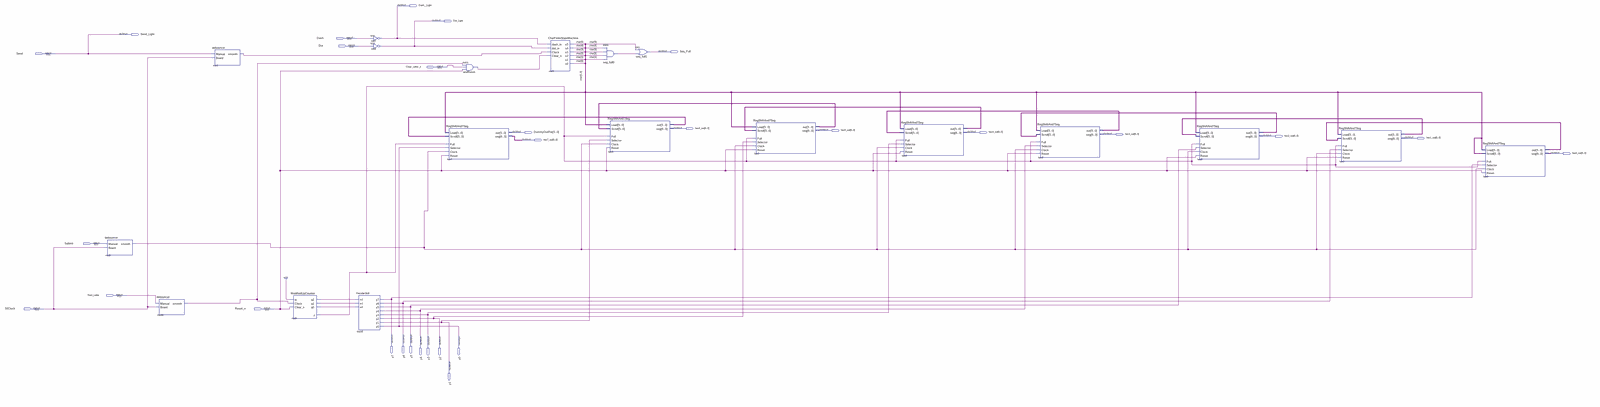
[diagram p0: schematic sheet, whole]
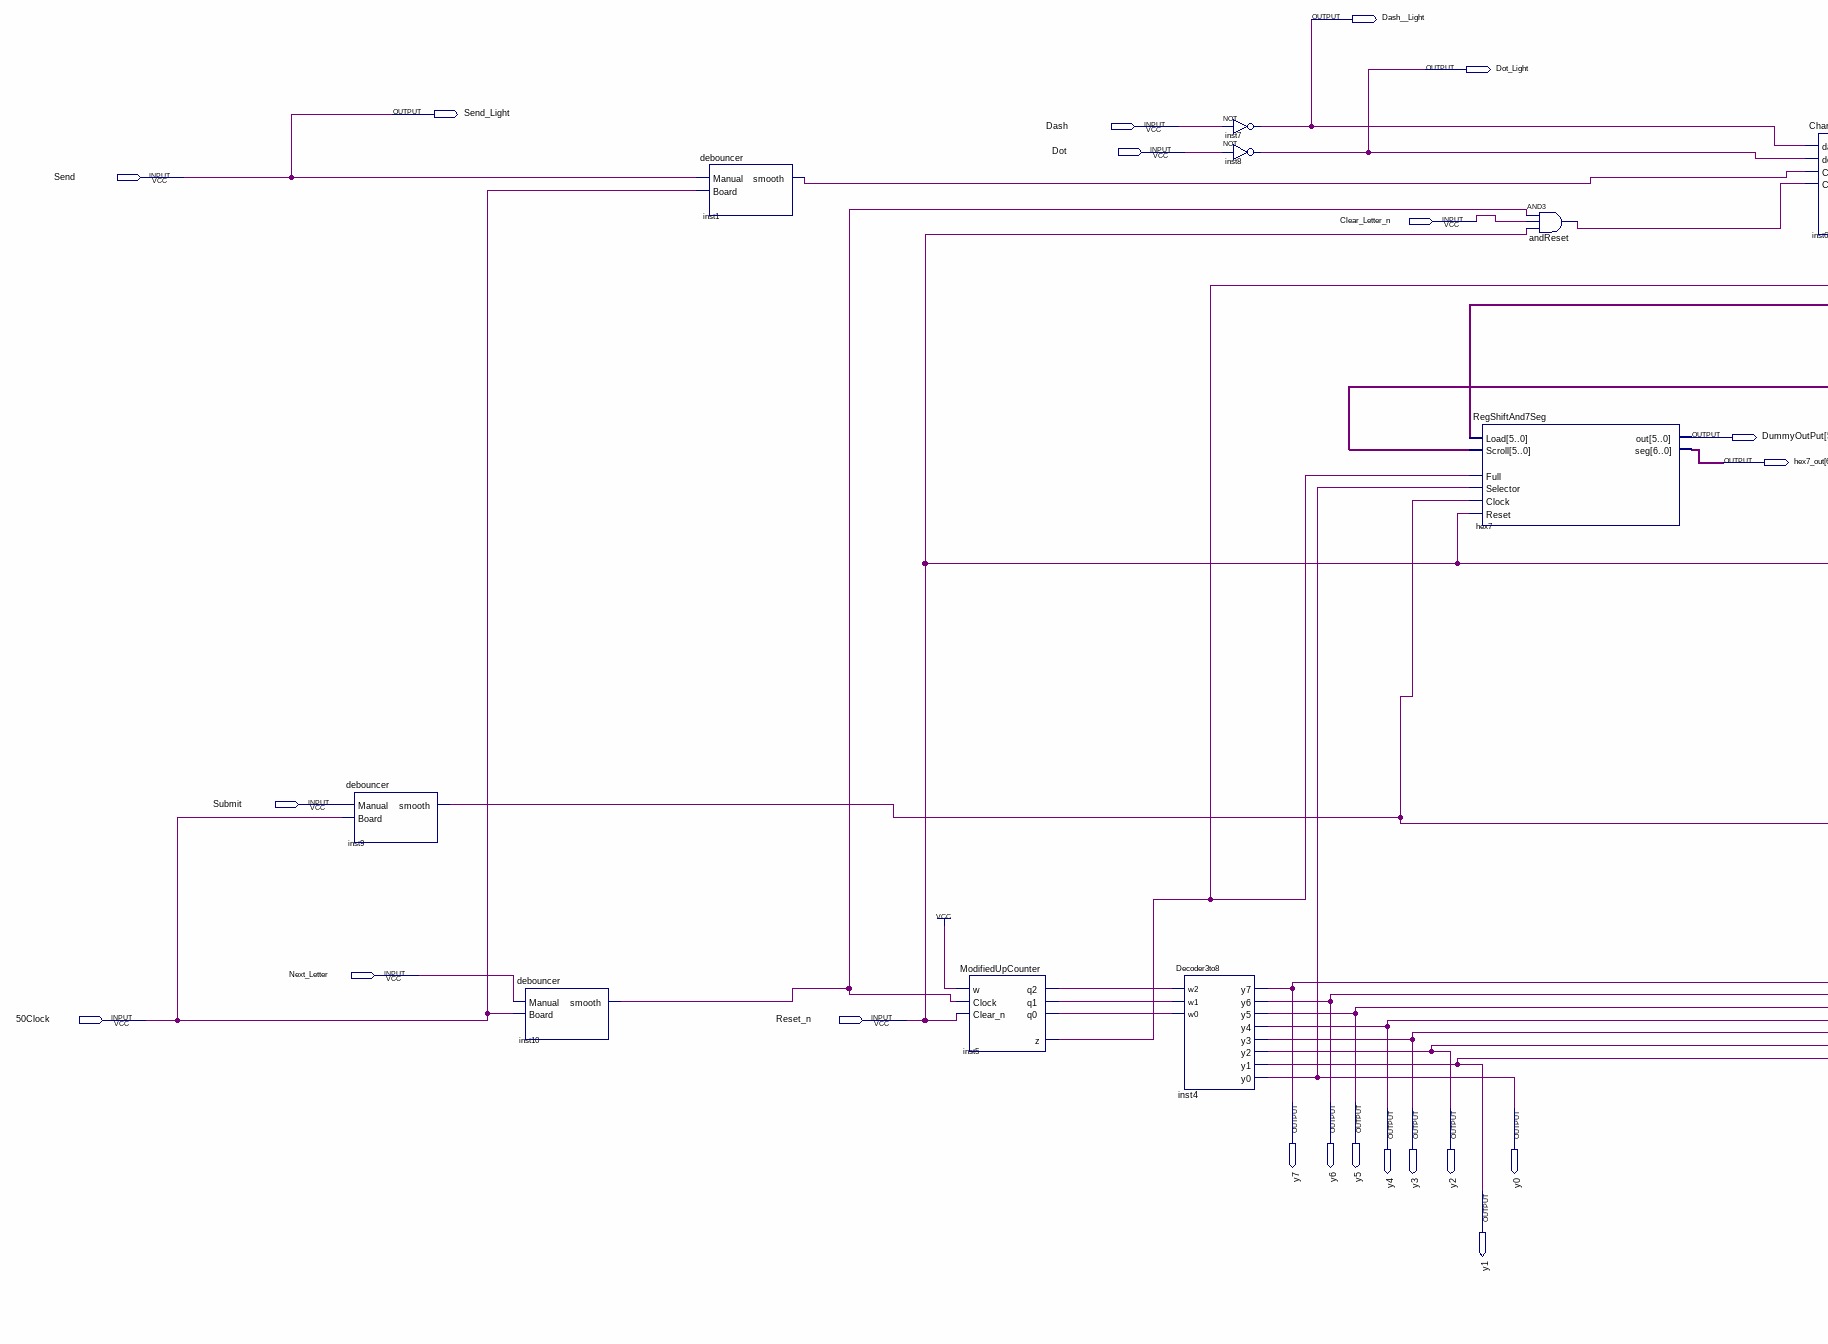
[diagram p1: schematic sheet, left part]
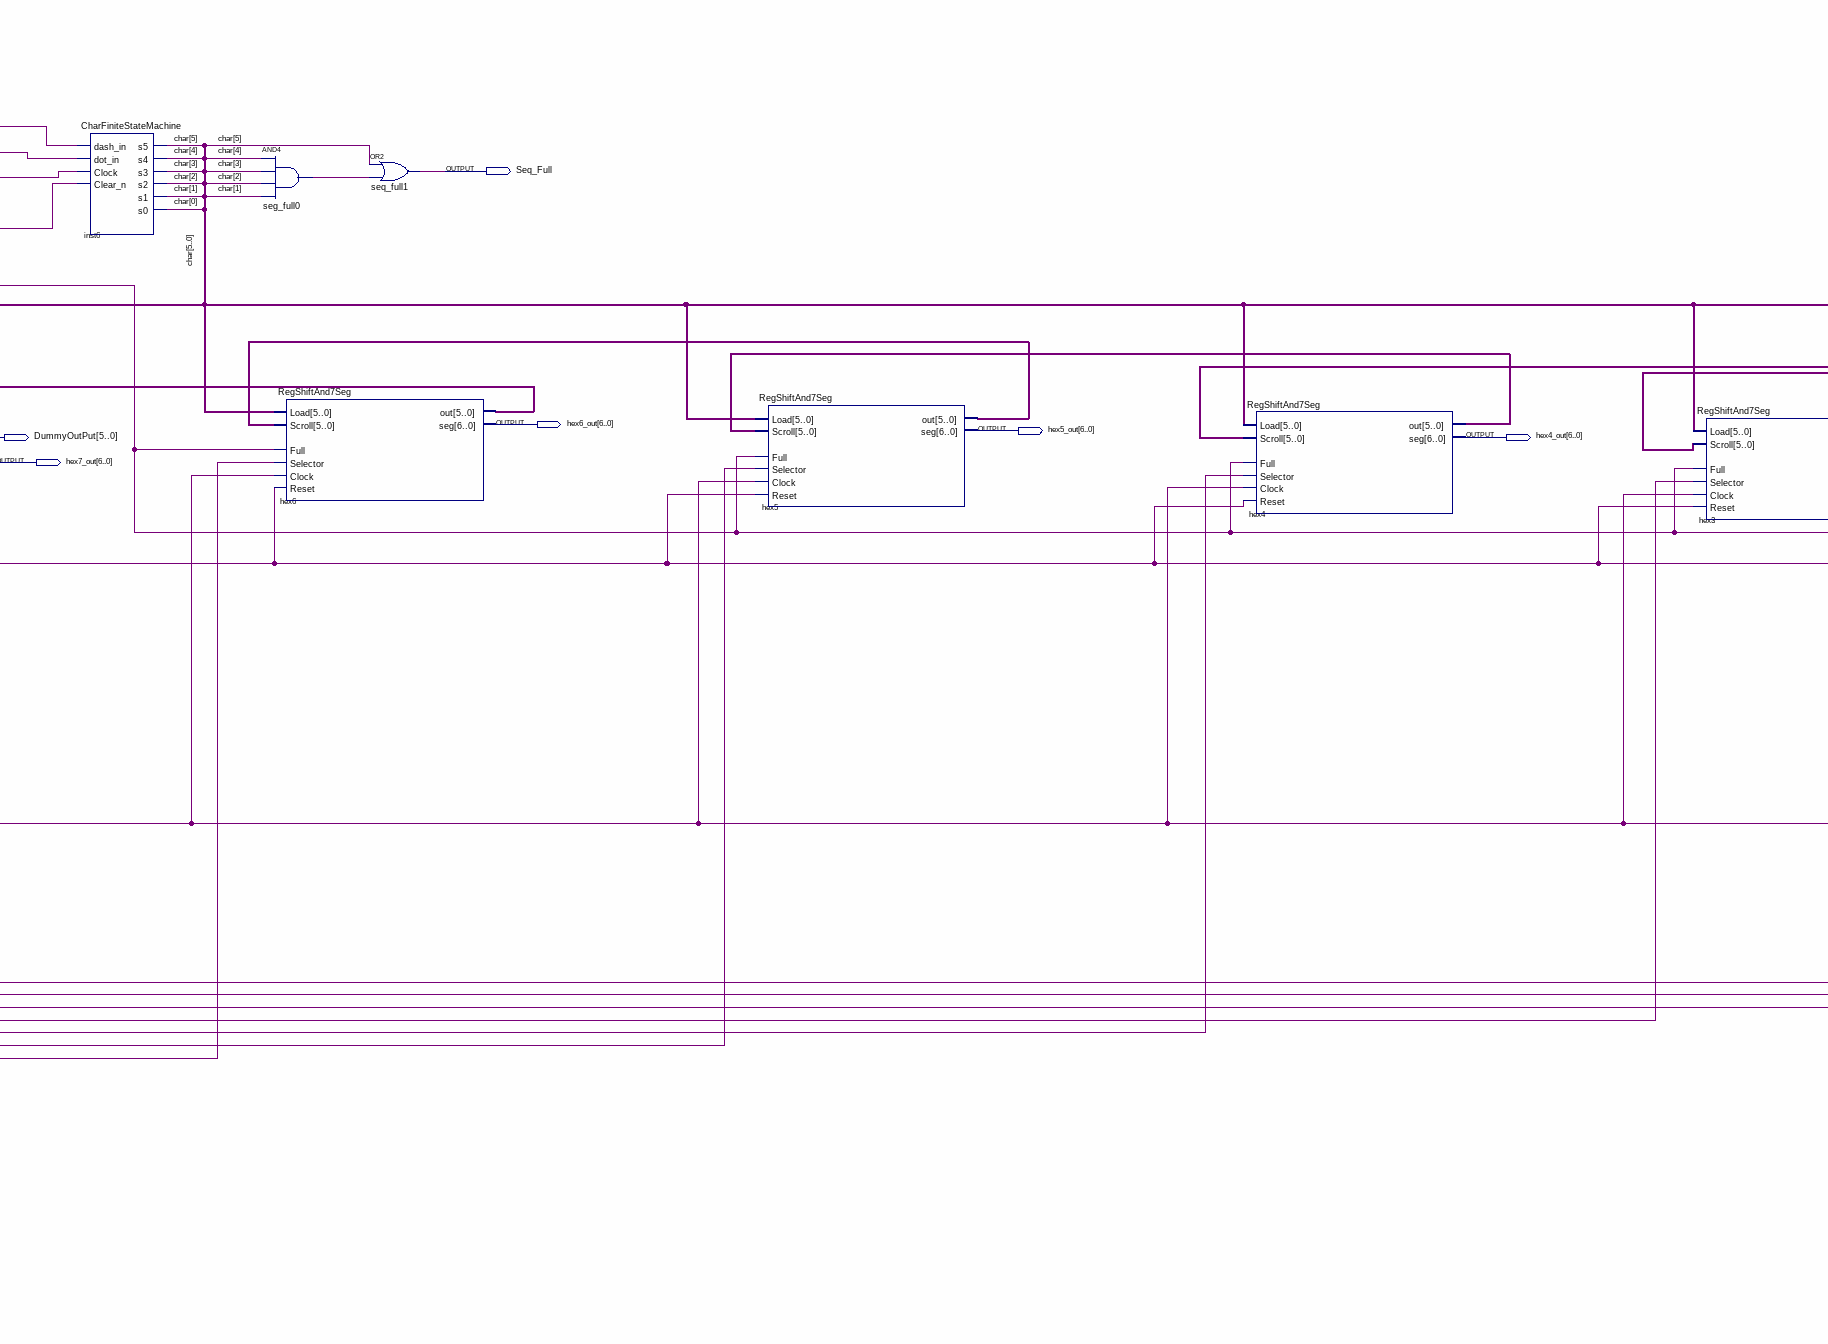
[diagram p2: schematic sheet, centre part]
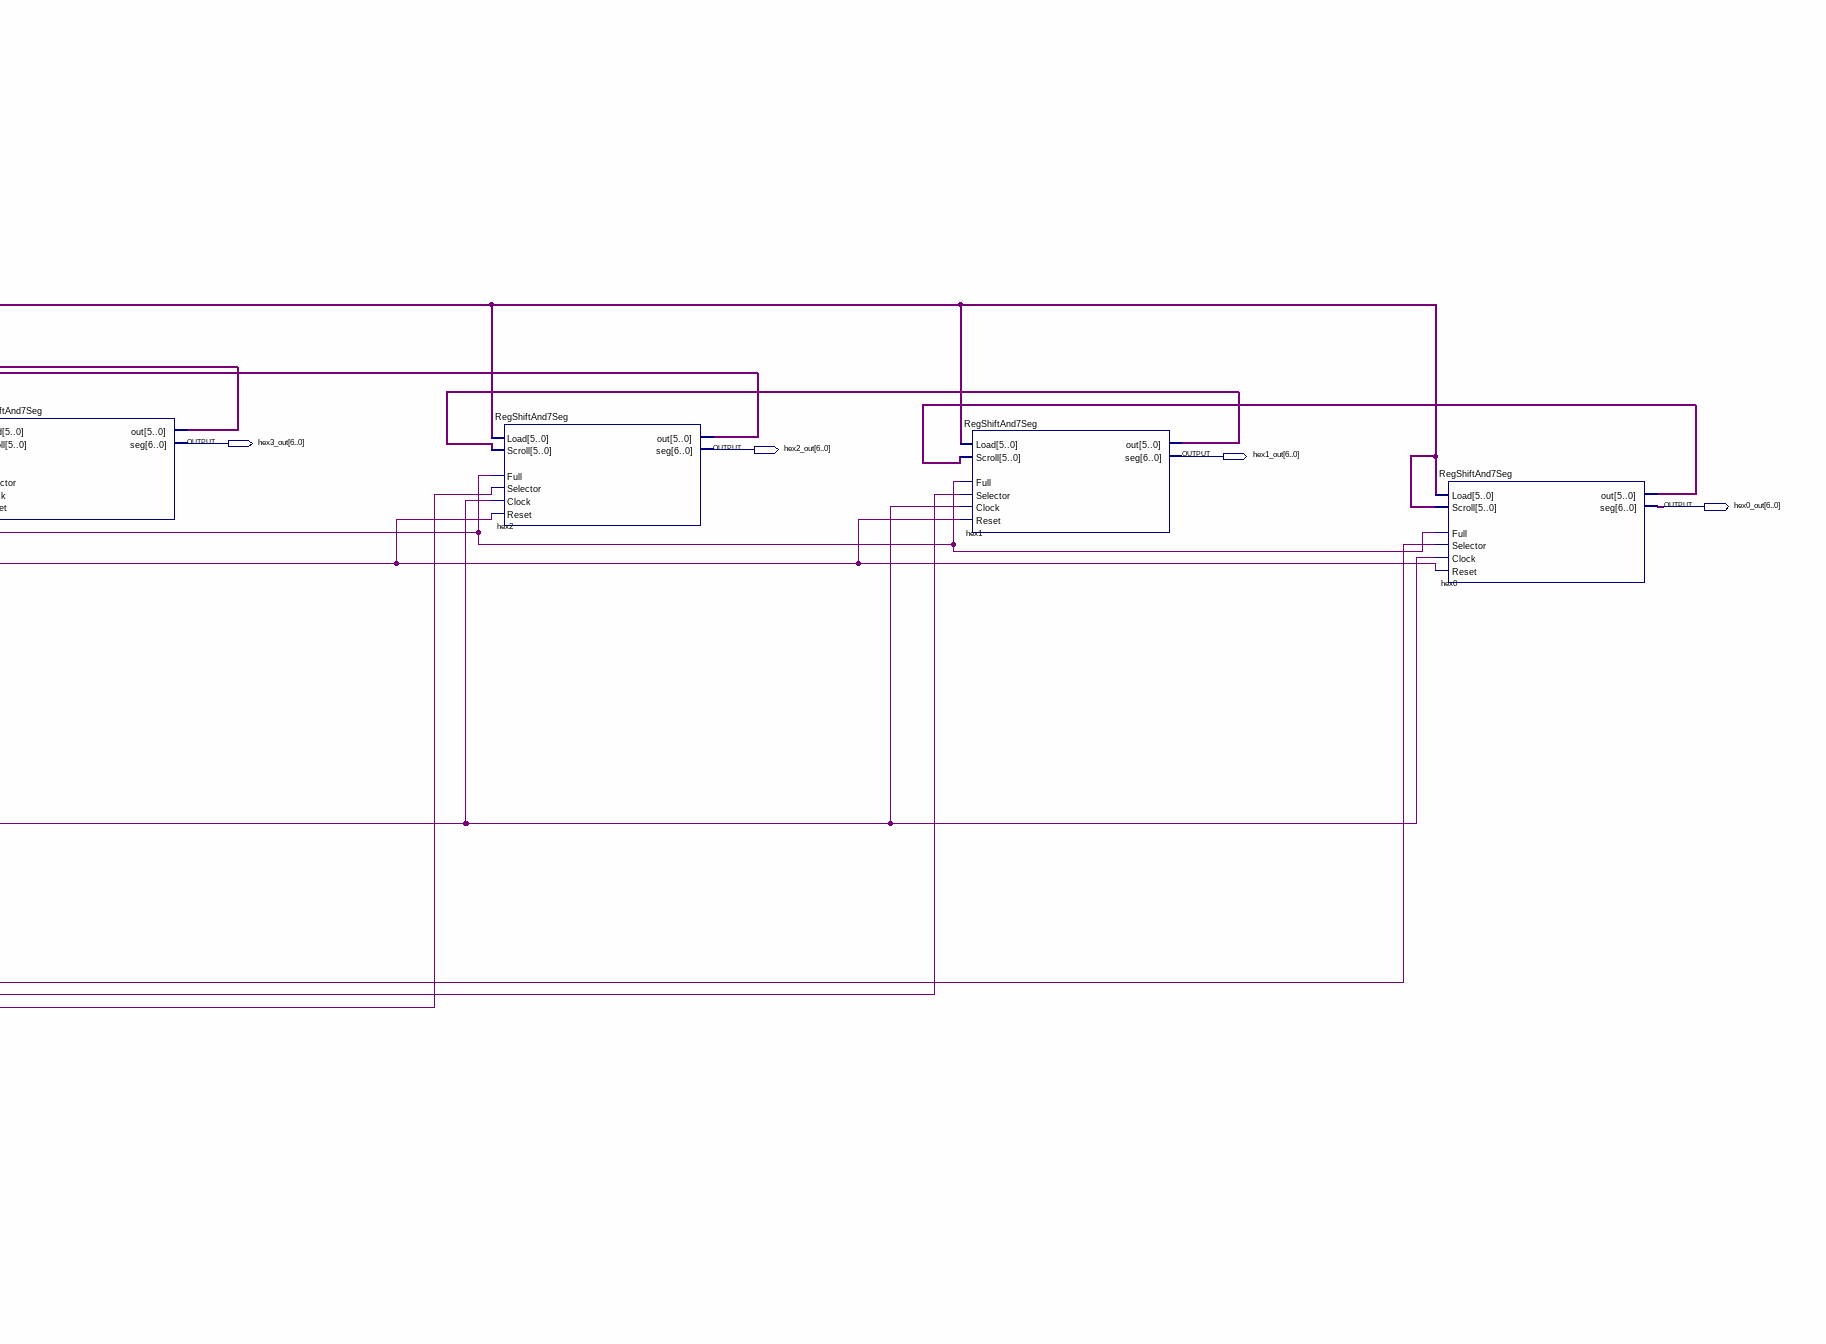
[diagram p3: schematic sheet, right part]
// Quartus schematic MorseCodeDecoder.bdf as structural Verilog: 19 symbols, 29 pins
module MorseCodeDecoder (
  input  Dash,
  input  Dot,
  input  Send,
  input  Clear_Letter_n,
  input  Submit,
  input  Next_Letter,
  input  \50Clock ,
  input  Reset_n,
  output Dash__Light,
  output Dot_Light,
  output Send_Light,
  output Seq_Full,
  output [6:0] hex6_out,
  output [6:0] hex5_out,
  output [5:0] DummyOutPut,
  output [6:0] hex4_out,
  output [6:0] hex3_out,
  output [6:0] hex2_out,
  output [6:0] hex1_out,
  output [6:0] hex7_out,
  output [6:0] hex0_out,
  output y7,
  output y6,
  output y5,
  output y4,
  output y3,
  output y2,
  output y0,
  output y1
);

  wire andReset_out, inst1_smooth, inst5_q0, inst5_q1, inst5_q2, inst5_z, inst9_smooth, inst10_smooth,
       seg_full0_out;
  wire [5:0] char, hex0_out_2, hex1_out_2, hex2_out_2, hex3_out_2, hex4_out_2, hex5_out_2, hex6_out_2;

  debouncer inst9 (.Manual(Submit), .Board(\50Clock ), .smooth(inst9_smooth));
  debouncer inst10 (.Manual(Next_Letter), .Board(\50Clock ), .smooth(inst10_smooth));
  debouncer inst1 (.Manual(Send), .Board(\50Clock ), .smooth(inst1_smooth));
  ModifiedUpCounter inst5 (
    .w(1'b1), .Clock(inst10_smooth), .Clear_n(Reset_n), .q2(inst5_q2), .z(inst5_z), .q1(inst5_q1),
    .q0(inst5_q0));
  Decoder3to8 inst4 (
    .w2(inst5_q2), .w1(inst5_q1), .w0(inst5_q0), .y7(y7), .y6(y6), .y5(y5), .y4(y4), .y3(y3), .y2(y2),
    .y1(y1), .y0(y0));
  not inst7 (Dash__Light, Dash);
  not inst8 (Dot_Light, Dot);
  RegShiftAnd7Seg hex7 (
    .Full(inst5_z), .Load(char), .Scroll(hex6_out_2), .Selector(y0), .Clock(inst9_smooth), .Reset(Reset_n),
    .seg(hex7_out), .out(DummyOutPut));
  and andReset (andReset_out, inst10_smooth, Clear_Letter_n, Reset_n);
  CharFiniteStateMachine inst6 (
    .dash_in(Dash__Light), .dot_in(Dot_Light), .Clock(inst1_smooth), .Clear_n(andReset_out), .s5(char[5]),
    .s4(char[4]), .s3(char[3]), .s2(char[2]), .s1(char[1]), .s0(char[0]));
  and seg_full0 (seg_full0_out, char[4], char[3], char[2], char[1]);
  RegShiftAnd7Seg hex6 (
    .Full(inst5_z), .Load(char), .Scroll(hex5_out_2), .Selector(y1), .Clock(inst9_smooth), .Reset(Reset_n),
    .seg(hex6_out), .out(hex6_out_2));
  or seq_full1 (Seq_Full, char[5], seg_full0_out);
  RegShiftAnd7Seg hex5 (
    .Full(inst5_z), .Load(char), .Scroll(hex4_out_2), .Selector(y2), .Clock(inst9_smooth), .Reset(Reset_n),
    .seg(hex5_out), .out(hex5_out_2));
  RegShiftAnd7Seg hex4 (
    .Full(inst5_z), .Load(char), .Scroll(hex3_out_2), .Selector(y3), .Clock(inst9_smooth), .Reset(Reset_n),
    .seg(hex4_out), .out(hex4_out_2));
  RegShiftAnd7Seg hex3 (
    .Full(inst5_z), .Load(char), .Scroll(hex2_out_2), .Selector(y4), .Clock(inst9_smooth), .Reset(Reset_n),
    .seg(hex3_out), .out(hex3_out_2));
  RegShiftAnd7Seg hex2 (
    .Full(inst5_z), .Load(char), .Scroll(hex1_out_2), .Selector(y5), .Clock(inst9_smooth), .Reset(Reset_n),
    .seg(hex2_out), .out(hex2_out_2));
  RegShiftAnd7Seg hex1 (
    .Full(inst5_z), .Load(char), .Scroll(hex0_out_2), .Selector(y6), .Clock(inst9_smooth), .Reset(Reset_n),
    .seg(hex1_out), .out(hex1_out_2));
  RegShiftAnd7Seg hex0 (
    .Full(inst5_z), .Load(char), .Scroll(char), .Selector(y7), .Clock(inst9_smooth), .Reset(Reset_n),
    .seg(hex0_out), .out(hex0_out_2));

  assign Send_Light = Send;
endmodule
